# Altium schematic sheet RF-CON-NFC.SchDoc: =ProjectTitle
size 209 x 297 mm; Scale: 1:1; Address1: Address1; Address2: Address2; Address3: Address3; Address4: Address4; SheetNumber: 9; SheetTotal: 9; DocumentType: Схема электрическая принципиальная
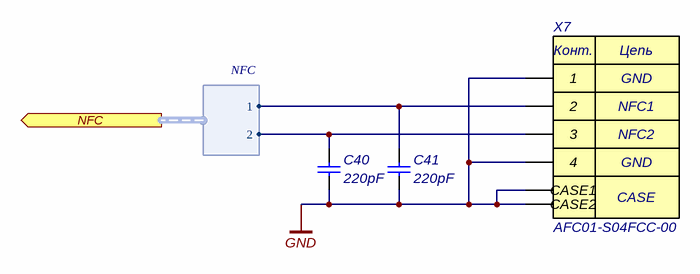
[diagram p0: RF-CON-NFC.SchDoc]

## Parts
C40  220pF  [C0402]
C41  220pF  [C0402]
X7  AFC01-S04FCC-00  [505110-0492]

## Ports
NFC (out, harness NFC)

## Harnesses
NFC: 1, 2

## Nets
GND: C40.2 C41.2 X7.1 X7.4 X7.CASE1 X7.CASE2
NetC40_1: C40.1 X7.3 ; port NFC.2
NetC41_1: C41.1 X7.2 ; port NFC.1

## Notes on the sheet
- GND
- NFC1
- NFC2
- Подп. и дата
- Инв. № дубл.
- Взам. инв. №
- Symbol name: =SheetSymbolDesignator
  File name: =DocumentName
  Variant name (Short): =ProjectVariant ( =ProjectBoardVariant )
  Version on board: =ProjectRevisionCode
- Инв. № подл.
- Изм.
- Лист
- № докум.
- Подп.
- Дата
- 2.106-A4
- Копировал
- Формат А4
- (in symbol AFC01-S04FCC-00) Конт.; Цепь; CASE

## Library data of the parts
C40 C41 = 0402-NP0-50V-220pF±5%: *; Manufacturer: Yageo; NameFromManufacturer: CC0402JRNPO9BN221; Place: S; Voltage: 50V; Tolerance: 5%; Check: False; Part Number: 0402-NP0-50V-220pF±5%; Value: 220pF; Temperature: -55°C~125°C; ComponentLink2Description: Link to datasheet; ComponentLink1Description: DATASHEET; ComponentLink2URL: https://octopart.com/cc0402jrnpo9bn221-yageo-42335946?r=sp#Specs; ComponentLink1URL: Datasheets/capacitors/MV.pdf; Last changed: 27.10.2022
X7 = AFC01-S04FCC-00: Clamshell 4P Bottom Contact Surface Mount, Right Angle 0.5mm, FFC/FPC Connector; Manufacturer: JUSHUO; Place: T; Check: False; Part Number: AFC01-S04FCC-00; Value: AFC01-S04FCC-00; Temperature: -25°C~85°C; ComponentLink1Description: DATASHEET; NameFromManufacturer: AFC01-S04FCC-00; ComponentLink1URL: https://www.lcsc.com/product-detail/FFC-FPC-Connectors_JUSHUO-AFC01-S04FCC-00_C262260.html; Last changed: 10.03.2024